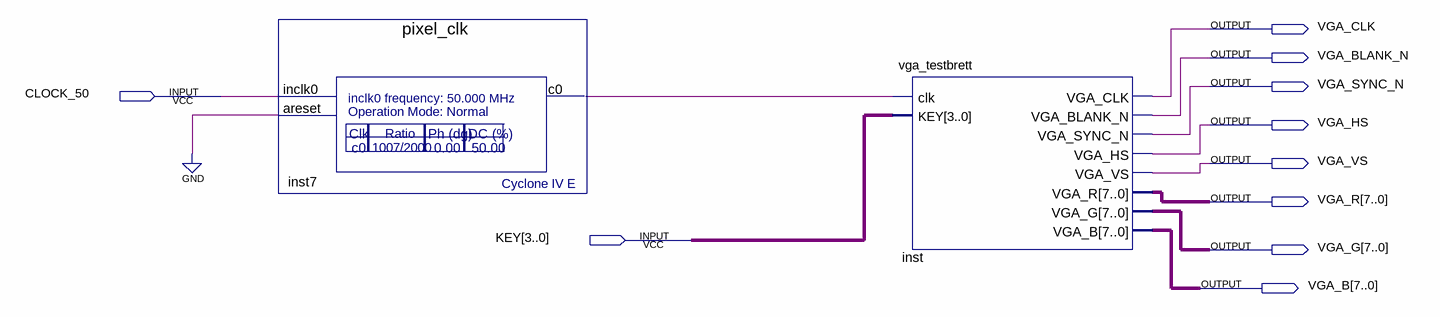
[diagram p0: schematic sheet]
// Quartus schematic vga_test_av_testbrett.bdf as structural Verilog: 2 symbols, 10 pins
module vga_test_av_testbrett (
  input  CLOCK_50,
  input  [3:0] KEY,
  output VGA_CLK,
  output VGA_BLANK_N,
  output VGA_SYNC_N,
  output VGA_HS,
  output VGA_VS,
  output [7:0] VGA_R,
  output [7:0] VGA_G,
  output [7:0] VGA_B
);

  wire inst7_c0;

  pixel_clk inst7 (.inclk0(CLOCK_50), .areset(1'b0), .c0(inst7_c0));
  vga_testbrett inst (
    .clk(inst7_c0), .KEY(KEY), .VGA_CLK(VGA_CLK), .VGA_BLANK_N(VGA_BLANK_N), .VGA_SYNC_N(VGA_SYNC_N),
    .VGA_HS(VGA_HS), .VGA_VS(VGA_VS), .VGA_R(VGA_R), .VGA_G(VGA_G), .VGA_B(VGA_B));
endmodule
